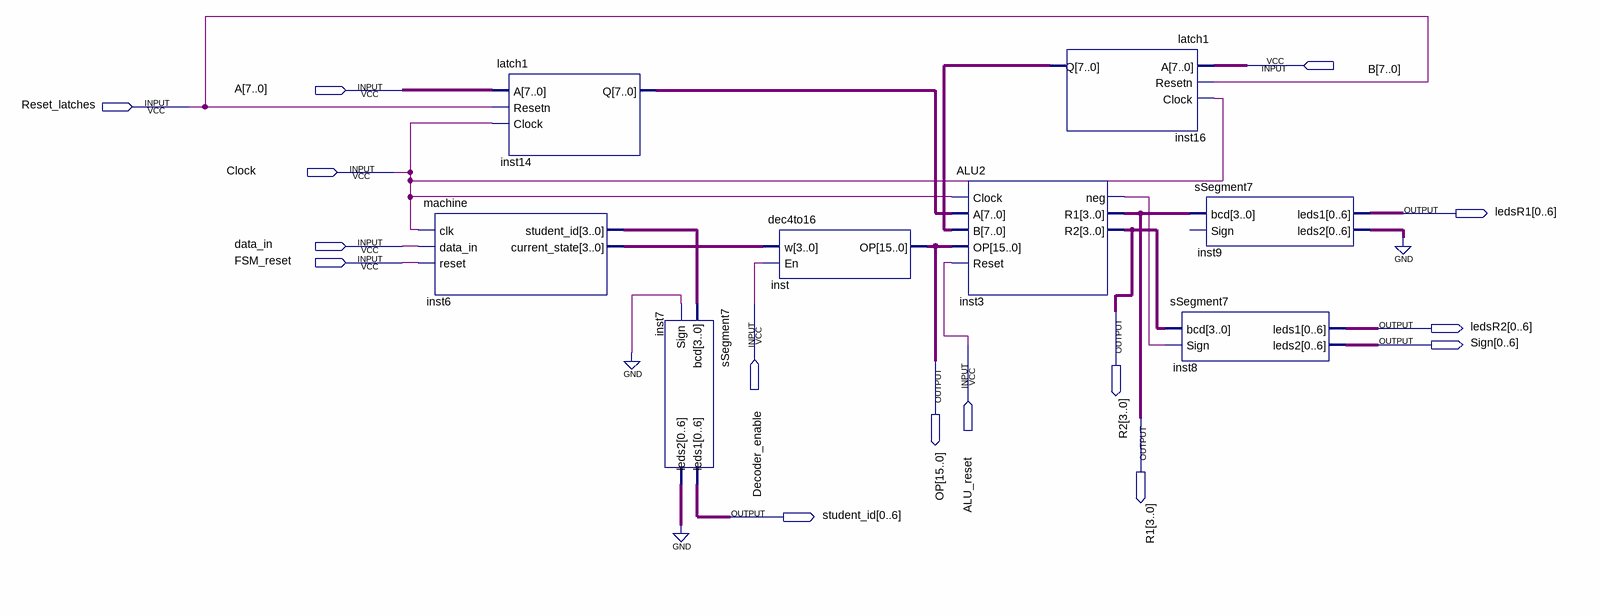
[diagram p0: schematic sheet]
// Quartus schematic Problem2.bdf as structural Verilog: 8 symbols, 15 pins
module Problem2 (
  input  [7:0] B,
  input  [7:0] A,
  input  Reset_latches,
  input  Clock,
  input  data_in,
  input  FSM_reset,
  input  Decoder_enable,
  input  ALU_reset,
  output [0:6] ledsR1,
  output [3:0] R2,
  output [0:6] ledsR2,
  output [0:6] Sign,
  output [15:0] OP,
  output [3:0] R1,
  output [0:6] student_id
);

  wire inst3_neg;
  wire [3:0] inst6_current_state, inst6_student_id;
  wire [6:0] inst7_leds2, inst9_leds2;
  wire [7:0] inst14_q, inst16_q;

  machine inst6 (
    .clk(Clock), .data_in(data_in), .reset(FSM_reset), .student_id(inst6_student_id),
    .current_state(inst6_current_state));
  latch1 inst14 (.A(A), .Resetn(Reset_latches), .Clock(Clock), .Q(inst14_q));
  sSegment7 inst7 (.bcd(inst6_student_id), .Sign(1'b0), .leds1(student_id), .leds2(inst7_leds2));
  dec4to16 inst (.w(inst6_current_state), .En(Decoder_enable), .OP(OP));
  ALU2 inst3 (.Clock(Clock), .A(inst14_q), .B(inst16_q), .OP(OP), .Reset(ALU_reset), .neg(inst3_neg), .R1(R1), .R2(R2));
  latch1 inst16 (.A(B), .Resetn(Reset_latches), .Clock(Clock), .Q(inst16_q));
  sSegment7 inst9 (.bcd(R1), .leds1(ledsR1), .leds2(inst9_leds2));  // open: Sign
  sSegment7 inst8 (.bcd(R2), .Sign(inst3_neg), .leds1(ledsR2), .leds2(Sign));
  // also tied to GND on the sheet: {inst7_leds2[0], inst7_leds2[1], inst7_leds2[2], inst7_leds2[3], inst7_leds2[4], inst7_leds2[5], inst7_leds2[6], inst9_leds2[0], inst9_leds2[1], inst9_leds2[2], inst9_leds2[3], inst9_leds2[4], inst9_leds2[5], inst9_leds2[6]}
endmodule
